# Altium project LimePSB-RPCM_1v4.PrjPcb (part 2 of 12)

## Sheet 06_Misc_1.SchDoc: Misc 1
size A3; Organization: Lime Microsystems; Address1: Surrey Tech Centre; Address2: Guildford GU2 7YG; Address3: Surrey; Address4: United Kingdom; Revision: 1.4; SheetNumber: 6; SheetTotal: 15
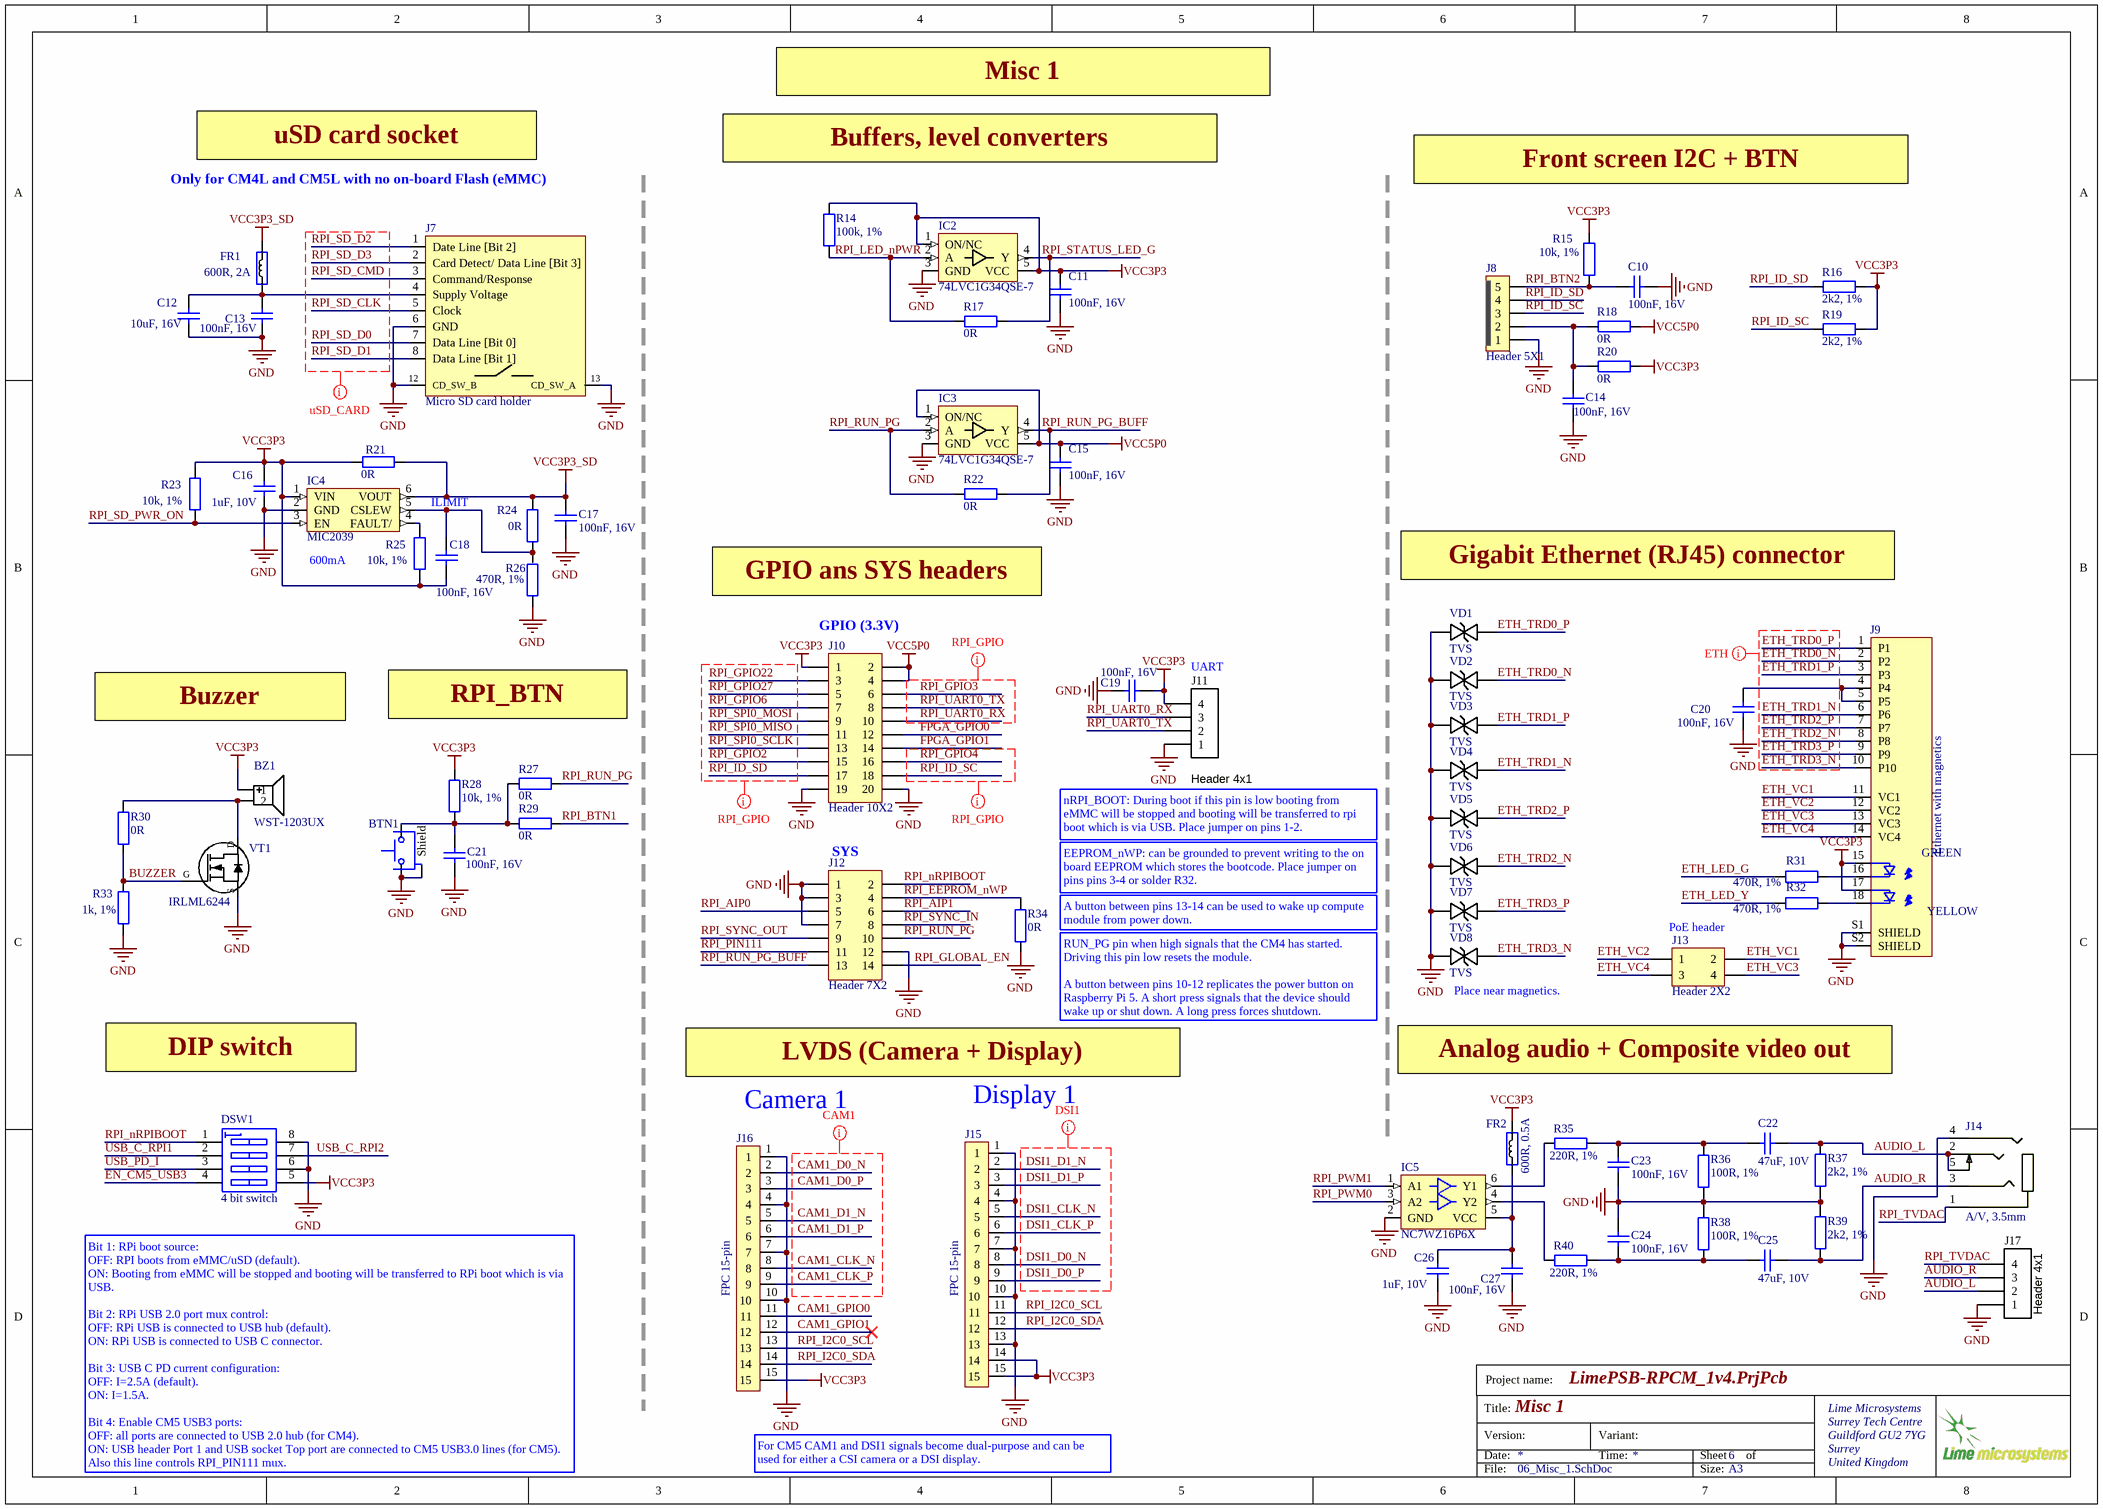
[diagram p5: 06_Misc_1.SchDoc]

### Parts
BTN1  Switch tactile right edge  [SW_TACTILE_RIGHT_EDGE]  (value not drawn)
BZ1  WST-1203UX  [BUZZER_WST-1203UX]
C10  100nF, 16V  [CAP0402]
C11  100nF, 16V  [CAP0402]
C12  10uF, 16V  [CAP0603]
C13  100nF, 16V  [CAP0402]
C14  100nF, 16V  [CAP0402]
C15  100nF, 16V  [CAP0402]
C16  1uF, 10V  [CAP0402]
C17  100nF, 16V  [CAP0402]
C18  100nF, 16V  [CAP0402]
C19  100nF, 16V  [CAP0402]
C20  100nF, 16V  [CAP0402]
C21  100nF, 16V  [CAP0402]
C22  47uF, 10V  [CAP1206]
C23  100nF, 16V  [CAP0402]
C24  100nF, 16V  [CAP0402]
C25  47uF, 10V  [CAP1206]
C26  1uF, 10V  [CAP0402]
C27  100nF, 16V  [CAP0402]
DSW1  4 bit switch  [SW_4WAY_SMD_1P27]
FR1  600R, 2A  [RES0805]
FR2  600R, 0.5A  [RES0402]
IC2  74LVC1G34QSE-7  [74AHCT1G126SE-7_BUFFER_SOT353]
IC3  74LVC1G34QSE-7  [74AHCT1G126SE-7_BUFFER_SOT353]
IC4  MIC2039  [SOT23-6]
IC5  NC7WZ16P6X  [SC-70_NC7WZ16P6X]
J7  Micro SD card holder  [MICRO_SD_CARD_114-00841-68_v2]
J8  Header 5X1  [Header1x5_TH_LOCKING]
J9  Ethernet with magnetics  [RJ45_ETHERNET_MAG_A70-112-331N126]
J10  Header 10X2  [HEADER10X2_TH_LOCK]
J11  Header 4x1  [HEADER4X1_TH]
J12  Header 7X2  [Header7x2_TH]
J13  Header 2X2  [Header2x2_TH]
J14  A/V, 3.5mm  [Audio_jack_3.5mm]
J15  FPC 15-pin  [FPC_CONNECTOR_15pin_1-1734248-5]
J16  FPC 15-pin  [FPC_CONNECTOR_15pin_1-1734248-5]
J17  Header 4x1  [HEADER4X1_TH]
R14  100k, 1%  [RES0402]
R15  10k, 1%  [RES0402]
R16  2k2, 1%  [RES0402]
R17  0R  [RES0402]
R18  0R  [RES0402]
R19  2k2, 1%  [RES0402]
R20  0R  [RES0402]
R21  0R  [RES0402]
R22  0R  [RES0402]
R23  10k, 1%  [RES0402]
R24  0R  [RES0402]
R25  10k, 1%  [RES0402]
R26  470R, 1%  [RES0402]
R27  0R  [RES0402_v2]
R28  10k, 1%  [RES0402]
R29  0R  [RES0402_v2]
R30  0R  [RES0402]
R31  470R, 1%  [RES0402]
R32  470R, 1%  [RES0402]
R33  1k, 1%  [RES0402]
R34  0R  [RES0402]
R35  220R, 1%  [RES0402]
R36  100R, 1%  [RES0402]
R37  2k2, 1%  [RES0402]
R38  100R, 1%  [RES0402]
R39  2k2, 1%  [RES0402]
R40  220R, 1%  [RES0402]
VD1  TVS  [SOD323]
VD2  TVS  [SOD323]
VD3  TVS  [SOD323]
VD4  TVS  [SOD323]
VD5  TVS  [SOD323]
VD6  TVS  [SOD323]
VD7  TVS  [SOD323]
VD8  TVS  [SOD323]
VT1  IRLML6244  [SOT23-3]

### Nets
GND: BTN1.2 BTN1.Shield C10.2 C11.2 C12.1 C13.2 C14.2 C15.2 C16.2 C17.2 C19.2 C20.2 C21.2 C23.2 C24.1 C26.1 C27.2 DSW1.6(B3) DSW1.8(B1) IC2.3(GND) IC3.3(GND) IC4.2(GND) IC5.2(GND) J7.6(GND) J7.12(CD_SW_B) J7.13(CD_SW_A) J8.1 J9.S1(SHIELD) J9.S2(SHIELD) J10.19 J10.20 J11.1 J12.1 J12.3 J12.7 J12.12 J14.4 J15.1 J15.4 J15.7 J15.10 J15.13 J16.1 J16.4 J16.7 J16.10 J17.1 R26.1 R33.2 R34.1 R36.1 R37.2 R38.2 R39.1 VD1.K VD2.K VD3.K VD4.K VD5.K VD6.K VD7.K VD8.K VT1.S
VCC3P3: BZ1.1 C11.1 C16.1 C18.2 C19.1 DSW1.5(B4) FR2.2 IC2.1(ON/NC) IC2.5(VCC) IC4.1(VIN) J9.15(G_A) J9.17(Y_A) J10.1 J11.4 J15.14 J15.15 J16.15 R14.1 R15.1 R16.2 R19.2 R20.1 R21.2 R23.2 R25.1 R28.1
VCC3P3_SD: C17.1 FR1.2 IC4.6(VOUT) R21.1 R24.2
VCC5P0: C15.1 IC3.1(ON/NC) IC3.5(VCC) J10.2 J10.4 R18.1
AUDIO_L: C22.1 J14.2 J14.5 J17.2 R37.1
AUDIO_R: C25.1 J14.3 J17.3 R39.2
BUZZER: R30.1 R33.1 VT1.G
CAM1_CLK_N: J16.8
CAM1_CLK_P: J16.9
CAM1_D0_N: J16.2
CAM1_D0_P: J16.3
CAM1_D1_N: J16.5
CAM1_D1_P: J16.6
CAM1_GPIO0: J16.11
CAM1_GPIO1: J16.12
DSI1_CLK_N: J15.5
DSI1_CLK_P: J15.6
DSI1_D0_N: J15.8
DSI1_D0_P: J15.9
DSI1_D1_N: J15.2
DSI1_D1_P: J15.3
EN_CM5_USB3: DSW1.4(A4)
ETH_LED_G: R31.2
ETH_LED_Y: R32.2
ETH_TRD0_N: J9.2(P2) VD2.A
ETH_TRD0_P: J9.1(P1) VD1.A
ETH_TRD1_N: J9.6(P6) VD4.A
ETH_TRD1_P: J9.3(P3) VD3.A
ETH_TRD2_N: J9.8(P8) VD6.A
ETH_TRD2_P: J9.7(P7) VD5.A
ETH_TRD3_N: J9.10(P10) VD8.A
ETH_TRD3_P: J9.9(P9) VD7.A
ETH_VC1: J9.11(VC1) J13.2
ETH_VC2: J9.12(VC2) J13.1
ETH_VC3: J9.13(VC3) J13.4
ETH_VC4: J9.14(VC4) J13.3
FPGA_GPIO0: J10.12
FPGA_GPIO1: J10.14
RPI_AIP0: J12.5
RPI_AIP1: J12.6
RPI_BTN1: R29.1
RPI_BTN2: C10.1 J8.5 R15.2
RPI_EEPROM_nWP: J12.4 R34.2
RPI_GLOBAL_EN: J12.14
RPI_GPIO2: J10.15
RPI_GPIO3: J10.6
RPI_GPIO4: J10.16
RPI_GPIO6: J10.7
RPI_GPIO22: J10.3
RPI_GPIO27: J10.5
RPI_I2C0_SCL: J15.11 J16.13
RPI_I2C0_SDA: J15.12 J16.14
RPI_ID_SC: J8.3 J10.18 R19.1
RPI_ID_SD: J8.4 J10.17 R16.1
RPI_LED_nPWR: IC2.2(A) R14.2 R17.2
RPI_nRPIBOOT: DSW1.1(A1) J12.2
RPI_PIN111: J12.11
RPI_PWM0: IC5.3(A2)
RPI_PWM1: IC5.1(A1)
RPI_RUN_PG: IC3.2(A) J12.10 R22.2 R27.1
RPI_RUN_PG_BUFF: IC3.4(Y) J12.13 R22.1
RPI_SD_CLK: J7.5(Clock)
RPI_SD_CMD: J7.3(Command/Response)
RPI_SD_D0: J7.7(Data_Line_[Bit_0])
RPI_SD_D1: J7.8(Data_Line_[Bit_1])
RPI_SD_D2: J7.1(Date_Line_[Bit_2])
RPI_SD_D3: J7.2(Card_Detect/_Data_Line_[Bit_3])
RPI_SD_PWR_ON: IC4.3(EN) R23.1
RPI_SPI0_MISO: J10.11
RPI_SPI0_MOSI: J10.9
RPI_SPI0_SCLK: J10.13
RPI_STATUS_LED_G: IC2.4(Y) R17.1
RPI_SYNC_IN: J12.8
RPI_SYNC_OUT: J12.9
RPI_TVDAC: J14.1 J17.4
RPI_UART0_RX: J10.10 J11.3
RPI_UART0_TX: J10.8 J11.2
USB_C_RPI1: DSW1.2(A2)
USB_C_RPI2: DSW1.7(B2)
USB_PD_I: DSW1.3(A3)
NetBTN1_1: BTN1.1 C21.1 R27.2 R28.2 R29.2
NetBZ1_2: BZ1.2 R30.2 VT1.D
NetC12_2: C12.2 C13.1 FR1.1 J7.4(Supply_Voltage)
NetC14_1: C14.1 J8.2 R18.2 R20.2
NetC18_1: C18.1 IC4.5(CSLEW) R24.1 R26.2
NetC20_1: C20.1 J9.4(P4) J9.5(P5)
NetC22_2: C22.2 C23.1 R35.2 R36.2
NetC24_2: C24.2 C25.2 R38.1 R40.2
NetC26_2: C26.2 C27.1 FR2.1 IC5.5(VCC)
NetIC4_4: IC4.4(FAULT/) R25.2
NetIC5_4: IC5.4(Y2) R40.1
NetIC5_6: IC5.6(Y1) R35.1
NetJ9_16: J9.16(G_K) R31.1
NetJ9_18: J9.18(Y_K) R32.1

### Layout directives
net class uSD_CARD: RPI_SD_CLK, RPI_SD_CMD, RPI_SD_D0, RPI_SD_D1, RPI_SD_D2, RPI_SD_D3
net class ETH: ETH_TRD0_N, ETH_TRD0_P, ETH_TRD1_N, ETH_TRD1_P, ETH_TRD2_N, ETH_TRD2_P, ETH_TRD3_N, ETH_TRD3_P
net class CAM1: CAM1_CLK_N, CAM1_CLK_P, CAM1_D0_N, CAM1_D0_P, CAM1_D1_N, CAM1_D1_P
net class DSI1: DSI1_CLK_N, DSI1_CLK_P, DSI1_D0_N, DSI1_D0_P, DSI1_D1_N, DSI1_D1_P
net class RPI_GPIO: RPI_GPIO2, RPI_GPIO3, RPI_GPIO4, RPI_GPIO6, RPI_GPIO22, RPI_GPIO27, RPI_ID_SC, RPI_ID_SD, RPI_SPI0_MISO, RPI_SPI0_MOSI, RPI_SPI0_SCLK, RPI_UART0_RX, RPI_UART0_TX

### Notes on the sheet
- Misc 1
- uSD card socket
- (near R14) Buffers, level converters
- Front screen I2C + BTN
- Only for CM4L and CM5L with no on-board Flash (eMMC)
- ILIMIT
- (near IC4) 600mA
- Gigabit Ethernet (RJ45) connector
- GPIO ans SYS headers
- (near J10) GPIO (3.3V)
- Buzzer
- RPI_BTN
- (near J11) UART
- (near J12) SYS
- (near J11) nRPI_BOOT: During boot if this pin is low booting from eMMC will be stopped and booting will be transferred to rpi boot which is via USB. Place jumper on pins 1-2.
- (near R34) EEPROM_nWP: can be grounded to prevent writing to the on board EEPROM which stores the bootcode. Place jumper on pins pins 3-4 or solder R32.
- (near R34) A button between pins 13-14 can be used to wake up compute module from power down.
- (near J13) PoE header
- (near R34) RUN_PG pin when high signals that the CM4 has started. Driving this pin low resets the module.
  A button between pins 10-12 replicates the power button on Raspberry Pi 5. A short press signals that the device should wake up or shut down. A long press forces shutdown.
- (near VD8) Place near magnetics.
- DIP switch
- LVDS (Camera + Display)
- (near J16) Camera 1
- (near J15) Display 1
- Analog audio + Composite video out
- (near DSW1) Bit 1: RPi boot source:
  OFF: RPI boots from eMMC/uSD (default).
  ON: Booting from eMMC will be stopped and booting will be transferred to RPi boot which is via USB.
  Bit 2: RPi USB 2.0 port mux control:
  OFF: RPi USB is connected to USB hub (default).
  ON: RPi USB is connected to USB C connector.
  Bit 3: USB C PD current configuration:
  OFF: I=2.5A (default).
  ON: I=1.5A.
  Bit 4: Enable CM5 USB3 ports:
  OFF: all ports are connected to USB 2.0 hub (for CM4).
  ON: USB header Port 1 and USB socket Top port are connected to CM5 USB3.0 lines (for CM5).
  Also this line controls RPI_PIN111 mux.
- For CM5 CAM1 and DSI1 signals become dual-purpose and can be used for either a CSI camera or a DSI display.
- Project name:
- Title:
- Version:
- Date:
- Variant:
- Time:
- Sheet
- of
- File:
- Size:
- A3
- (in symbol RJ45_ETHERNET_MAG_A70-112-331N126) GREEN; YELLOW

### Library data of the parts
BTN1 = Button_right_edge: Part Description: Tactile Switch SPST-NO Side Actuated Through Hole, Right Angle; Manufacturer: CIT Relay & Switch; Manufacturer Part Number 1: CT1102V6.85F160; ComponentLink1URL: http://www.te.com/commerce/DocumentDelivery/DDEController?Action=srchrtrv&DocNm=1825027&DocType=Customer+Drawing&DocLang=English; ComponentLink1Description: http://www.te.com/commerce/DocumentDelivery/DDEController?Action=srchrtrv&DocNm=1825027&DocType=Customer+Drawing&DocLang=English; Supplier 1: Digikey; Supplier Part Number 1: 2449-CT1102V6.85F160-ND; Stock 1: 870; Pricing 1: 1=0,17, 10=0,167, 25=0,1584, 100=0,1436, 250=0,13088, 500=0,12164, 1000=0,10377, 3000=0,1015 (USD); RoHS: No
BZ1 = BUZZER_WST-1203UX: Manufacturer: Soberton Inc.; Part Description: Buzzers Indicator, Internally Driven Magnetic 3V 30mA 2.3kHz 82dB @ 3V, 10cm Through Hole PC Pins; Driver Circuitry: Indicator, Internally Driven; Input Type: Zero-Peak Signal; Voltage Range: 2 ~ 4V; Frequency: 2.3kHz; Operating Mode: Single Tone; Sound Pressure Level (SPL): 82dB @ 3V, 10cm; Current - Supply: 30mA; Port Location: Top; Ratings: Washable; Supplier 1: Digi-Key; Manufacturer Part Number 1: WST-1203UX; RoHS: RoHS Compliant; Category: Audio Products; Stock 1: 22696; Pricing 1: 1=1.41, 10=1.117, 25=1.0176, 50=0.9516, 100=0.8855, 250=0.80852, 500=0.7535, 1000=0.704, 5000=0.6875 (USD); Packaging: Tray; Part Status: Active; Technology: Magnetic; Duration: -; Operating Temperature: -20°C ~ 60°C; Approvals: -; Mounting Type: Through Hole; Termination: PC Pins; Size / Dimension: 0.472" Dia (12.00mm); Height - Seated (Max): 0.303" (7.70mm); ComponentLink1URL: http://cirlw3yrzg4afc1x47lv2k18.wpengine.netdna-cdn.com/wp-content/uploads/2016/12/WST-1203UX-new.pdf; ComponentLink1Description: http://cirlw3yrzg4afc1x47lv2k18.wpengine.netdna-cdn.com/wp-content/uploads/2016/12/WST-1203UX-new.pdf; Supplier Part Number 1: 433-1047-ND
C10 C13 C14 C19 C21 = Cap_0603: Manufacturer Part Number 1: GRM155R71C104KA88D; Part Description: 0.10µF ±10% 16V Ceramic Capacitor X7R 0402 (1005 Metric); Brand: Murata Electronics; Tolerance: 10 %; Type: General Purpose MLCC; Capacitance: 0.1 uF; Temperature Coefficient / Code: +/- 15 %; Supplier 1: Mouser; Supplier Part Number 1: 81-GRM155R71C104KA88; Case Code - in: 0402; Manufacturer: Murata Electronics; Category: Multilayer Ceramic Capacitors MLCC - SMD/SMT; Voltage Rating DC: 16 V; Value: 100nF, 16V; Manufacturer Part Number: GRM155R71C104KA88D
  C13 C19: Maximum Operating Temperature: + 125 C; Minimum Operating Temperature: - 55 C; Minimum Order Quantity: 1; Operating Temperature Range: - 55 C to + 125 C; Package / Case: 0402 (1005 metric); Packaging: Reel; Product: General Type MLCCs; Product Category: Low & Medium Capacitance SMD Ceramic Chip Capacitors; Reeling: True; RoHS - Mouser: Y; RoHS: RoHS Compliant; Series: GRM; Standard Pack Qty: 10000; Termination Style: SMD/SMT
C11 C15 C20 C23 C24 C27 = Cap_0402: Manufacturer: Murata Electronics; Manufacturer Part Number: GRM155R71C104KA88D; Part Description: 0.10µF ±10% 16V Ceramic Capacitor X7R 0402 (1005 Metric); Tolerance: 10 %; Type: General Purpose MLCC; Capacitance: 0.1 uF; Case Length: 1 mm; Dielectric: X7R; Case Height: 0.5 mm; Temperature Coefficient / Code: +/- 15 %; Value: 100nF, 16V; Supplier 1: Mouser; Supplier Part Number 1: 81-GRM155R71C104KA88; Case Code - in: 0402; RoHS: RoHS Compliant; Operating Temperature Range: - 55 C to + 125 C; Series: GRM; Termination Style: SMD/SMT; Package / Case: 0402 (1005 metric); Voltage Rating DC: 16 V; Maximum Operating Temperature: + 125 C; Case Code - mm: 1005; Minimum Operating Temperature: - 55 C; Product Category: Low & Medium Capacitance SMD Ceramic Chip Capacitors; Packaging: Reel; Product: General Type MLCCs; Category: Multilayer Ceramic Capacitors MLCC - SMD/SMT; Brand: Murata Electronics; Case Width: 0.5 mm; RoHS - Mouser: Y; Standard Pack Qty: 10000; Minimum Order Quantity: 1; Reeling: True; Manufacturer Part Number 1: GRM155R71C104KA88D
C12 = Cap_0603: Manufacturer: Yageo; Manufacturer Part Number 1: GRM188R61C106MA73D; Part Description: 10µF ±20% 16V Ceramic Capacitor X5R 0603 (1608 Metric); Temperature Coefficient: X5R; Capacitance: 10µF; Tolerance: ±20%; Value: 10uF, 16V; Supplier 1: Digi-Key; Supplier Part Number 1: 490-7201-2-ND; Category: Capacitors; Ratings: -; Features: -; Lead Style: -; Package / Case: 0603 (1608 Metric); Lead Spacing: -; Applications: General Purpose; Voltage - Rated: 16V; Operating Temperature: -55°C ~ 85°C; Thickness (Max): 0.039" (1.00mm); Mounting Type: Surface Mount, MLCC; RoHS: RoHS Compliant; Size / Dimension: 0.063" L x 0.031" W (1.60mm x 0.80mm); Packaging: Tape & Reel (TR); Height - Seated (Max): -
C16 = Cap_0402: Manufacturer Part Number 1: CC0402MRX5R6BB105; Manufacturer: Yageo; Part Description: 1µF 10V Ceramic Capacitor X5R 0402 (1005 Metric) 0.039" L x 0.020" W (1.00mm x 0.50mm); Voltage Rating: 10; Capacitance Tolerance: ± 10%; Product Range: TDK - C Series; Ceramic Capacitor Case: 0402 [1005 Metric]; Capacitance: 1; Dielectric Characteristic: X6; Value: 1uF, 10V; Supplier 1: Digi-Key; Supplier Part Number 1: 311-1732-1-ND; MSL: -; RoHS: YES
C17 C18 = Cap_0402: Manufacturer: Murata Electronics; Manufacturer Part Number 1: GRM155R71C104KA88D; Part Description: 0.10µF ±10% 16V Ceramic Capacitor X7R 0402 (1005 Metric); Tolerance: 10 %; Type: General Purpose MLCC; Capacitance: 0.1 uF; Case Length: 1 mm; Dielectric: X7R; Case Height: 0.5 mm; Temperature Coefficient / Code: +/- 15 %; Value: 100nF, 16V; Supplier 1: Mouser; Supplier Part Number 1: 81-GRM155R71C104KA88; Case Code - in: 0402; RoHS: RoHS Compliant; Operating Temperature Range: - 55 C to + 125 C; Series: GRM; Termination Style: SMD/SMT; Package / Case: 0402 (1005 metric); Voltage Rating DC: 16 V; Maximum Operating Temperature: + 125 C; Case Code - mm: 1005; Minimum Operating Temperature: - 55 C; Product Category: Low & Medium Capacitance SMD Ceramic Chip Capacitors; Packaging: Reel; Product: General Type MLCCs; Category: Multilayer Ceramic Capacitors MLCC - SMD/SMT; Brand: Murata Electronics; Case Width: 0.5 mm; RoHS - Mouser: Y; Standard Pack Qty: 10000; Minimum Order Quantity: 1; Reeling: True; Manufacturer Part Number: GRM155R71C104KA88D
C22 C25 = Cap_1206: Manufacturer: TDK Corporation; Manufacturer Part Number 1: C3216X6S1A476M160AC; Part Description: 47µF ±20% 10V Ceramic Capacitor X6S 1206 (3216 Metric); Notification: Current market demand for these product types have resulted in fluctuating and extending lead times. Lead times may differ.; Tolerance: ±20%; Temperature Coefficient: X6S; Value: 47uF, 10V; RoHS: RoHS Compliant; Packaging: Cut Tape (CT); Operating Temperature: -55°C ~ 105°C; Voltage - Rated: 10V; Height - Seated (Max): -; Ratings: -; Applications: General Purpose; Features: Low ESL; Size / Dimension: 0.126" L x 0.063" W (3.20mm x 1.60mm); Supplier 1: Digi-Key; Lead Spacing: -; Supplier Part Number 1: 445-6010-1-ND; Thickness (Max): 0.071" (1.80mm); Failure Rate: -; Category: Capacitors; Lead Style: -; Part Status: Active; Mounting Type: Surface Mount, MLCC; Package / Case: 1206 (3216 Metric)
C26 = Cap_0402: CAP CER 1UF 10V X5R 0402; Manufacturer: Yageo; Part Description: 1µF 10V Ceramic Capacitor X5R 0402 (1005 Metric) 0.039" L x 0.020" W (1.00mm x 0.50mm); Manufacturer Part Number 1: CC0402MRX5R6BB105; Notification: Current market demand for these product types have resulted in fluctuating and extending lead times. Lead times may differ.; Tolerance: ±20%; Value: 1uF, 10V; Supplier 1: Digi-Key; Supplier Part Number 1: 311-1732-1-ND; RoHS: RoHS Compliant; Applications: General Purpose; Category: Capacitors; ComponentLink1Description: http://www.yageo.com/documents/recent/UPY-GPHC_X5R_4V-to-50V_25.pdf; ComponentLink1URL: http://www.yageo.com/documents/recent/UPY-GPHC_X5R_4V-to-50V_25.pdf; Failure Rate: -; Features: -; Height - Seated (Max): -; Lead Spacing: -; Lead Style: -; Mounting Type: Surface Mount, MLCC; Operating Temperature: -55°C ~ 85°C; Package / Case: 0402 (1005 Metric); Packaging: Cut Tape (CT); Part Status: Active; Pricing 1: 1=0.22, 10=0.156, 100=0.0732, 500=0.0513, 1000=0.04248, 2500=0.03953, 5000=0.03617 (USD); Ratings: -; Size / Dimension: 0.039" L x 0.020" W (1.00mm x 0.50mm); Stock 1: 69600; Temperature Coefficient: X5R; Thickness (Max): 0.022" (0.55mm); Voltage - Rated: 10V
DSW1 = SW_SM_4bit: Manufacturer Part Number 1: A6H-4101; Manufacturer: Omron Electronics Inc-EMC Div; Part Description: Dip Switch SPST 4 Position Surface Mount Slide (Standard) Actuator 25mA 24VDC; Pitch: 0.050" (1.27mm), Half; Mechanical Life: 1,000 Cycles; Washable: No; Current Rating: 25mA; Number of Positions: 4; Voltage Rating: 24VDC; Actuator Level: Flush, Recessed; Circuit: SPST; Actuator Type: Slide (Standard); Supplier 1: Digi-Key; Height Above Board: 0.061" (1.55mm); RoHS: RoHS Compliant; Termination Style: Gull Wing; Electrical Life: 1,000 Cycles; Length: 0.248" (6.31mm); Category: Switches; Operating Temperature: -20°C ~ 70°C; Body Material: -; Contact Material: -; Features: -; Mounting Type: Surface Mount; Contact Finish: -; Packaging: Tube; Supplier Part Number 1: SW1080-ND
FR1 = Ferrite: Manufacturer Part Number 1: MPZ2012S601AT000; Manufacturer: TDK Corporation; Part Description: FERRITE BEAD 600 OHM 0805 1LN; Filter Type: Differential Mode - Single; Impedance @ Frequency: 600 Ohm @ 100MHz; DC Resistance (DCR): 100 mOhm Max; Supplier 1: Digi-Key; Supplier Part Number 1: 445-2206-2-ND; Mounting Type: Surface Mount; RoHS: RoHS Compliant; Height (Max): 0.041" (1.05mm); Packaging: Tape & Reel (TR); Category: Filters; Current Rating: 2A; Package / Case: 0805 (2012 Metric); Size / Dimension: 0.079" L x 0.049" W (2.00mm x 1.25mm)
FR2 = Ferrite: Manufacturer: Murata; Manufacturer Part Number 1: BLM15AX601SN1D; Part Description: - Ferrite Bead 0402 (1005 Metric) 500mA 340mOhm; Tolerance: 25%; Current Rating: 500mA; Number of Lines: 1; DC Resistance (DCR): 340mR; Test Frequency: 100MHz; Value: 600R, 0.5A; Supplier 1: Digi-Key; Supplier Part Number 1: 490-5441-1-ND; Stock 1: 416370; Pricing 1: 1=0.1, 10=0.06, 25=0.0552, 50=0.0496, 100=0.0363, 250=0.0264, 500=0.0242, 1000=0.0209, 5000=0.0165 (USD); Case/Package: 0402; Number of Pins: 2; Case Code (Metric): 1005; Case Code (Imperial): 0402; Core Material: Ferrite; Material: Steel,Ferrite; Min Operating Temperature: -55°C; Max Operating Temperature: 125°C; Package Quantity: 1; Packaging: Tape and Reel; Series: BLM15AX_SN; Impedance: 600R; Max Current Rating: 500mA; Termination: SMD/SMT; Max DC Current: 500mA; Number of Circuits: 1; DC Resistance-Max: 340mR; Length: 1mm; Width: 0.5mm; Height: 0.5mm; Depth: 0.5mm; REACH SVHC: No SVHC; Lead Free: Lead Free; RoHS Compliant: Yes; ComponentLink1URL: https://www.murata.com/en-us/products/productdata/8796740059166/ENFA0018.pdf?src-supplier=Digi-Key; ComponentLink1Description: https://www.murata.com/en-us/products/productdata/8796740059166/ENFA0018.pdf?src-supplier=Digi-Key; ComponentLink2URL: http://search.murata.co.jp/Ceramy/image/img/PDF/ENG/L0110S0100BLM15AX_SN.pdf?src-supplier=Future+Electronics; ComponentLink2Description: http://search.murata.co.jp/Ceramy/image/img/PDF/ENG/L0110S0100BLM15AX_SN.pdf?src-supplier=Future+Electronics; ComponentLink3URL: http://www.produktinfo.conrad.com/datenblaetter/1100000-1199999/001171675-da-01-en-CHIP_DROSSEL0402_600R_420MA_1_0X0_5MM.pdf?src-supplier=Conrad; ComponentLink3Description: http://www.produktinfo.conrad.com/datenblaetter/1100000-1199999/001171675-da-01-en-CHIP_DROSSEL0402_600R_420MA_1_0X0_5MM.pdf?src-supplier=Conrad; ComponentLink4URL: http://www.produktinfo.conrad.com/datenblaetter/1100000-1199999/001172169-da-01-en-DROSSEL_0402_600R_1_0X0_5MM_10000ST.pdf?src-supplier=Conrad; ComponentLink4Description: http://www.produktinfo.conrad.com/datenblaetter/1100000-1199999/001172169-da-01-en-DROSSEL_0402_600R_1_0X0_5MM_10000ST.pdf?src-supplier=Conrad
IC2 IC3 = 74AHCT1G126SE-7_BUFFER_NON_INV: Part Description: Buffers & Line Drivers Logic LVC 1 Gate SOT353 T&R 3K; Manufacturer: Diodes; ComponentLink1URL: https://datasheet.ciiva.com/12256/74ahct1g126-80154-12256741.pdf?src-supplier=Mouser; ComponentLink1Description: https://datasheet.ciiva.com/12256/74ahct1g126-80154-12256741.pdf?src-supplier=Mouser; ComponentLink2URL: https://datasheet.ciiva.com/26949/getdatasheetpartid-792439-26949318.pdf?src-supplier=Verical; ComponentLink2Description: https://datasheet.ciiva.com/26949/getdatasheetpartid-792439-26949318.pdf?src-supplier=Verical; ComponentLink3URL: https://datasheet.ciiva.com/1832/74ahct1g126-1832523.pdf?src-supplier=Digi-Key; ComponentLink3Description: https://datasheet.ciiva.com/1832/74ahct1g126-1832523.pdf?src-supplier=Digi-Key; ComponentLink4URL: https://datasheet.ciiva.com/1832/74ahct1g126-1832524.pdf?src-supplier=Digi-Key; ComponentLink4Description: https://datasheet.ciiva.com/1832/74ahct1g126-1832524.pdf?src-supplier=Digi-Key; ComponentLink5URL: https://datasheet.ciiva.com/1154/74ahct1g126-1154309.pdf?src-supplier=Element14; ComponentLink5Description: https://datasheet.ciiva.com/1154/74ahct1g126-1154309.pdf?src-supplier=Element14; ComponentLink6URL: https://datasheet.ciiva.com/26939/getdatasheetpartid-779272-26939183.pdf?src-supplier=Verical; ComponentLink6Description: https://datasheet.ciiva.com/26939/getdatasheetpartid-779272-26939183.pdf?src-supplier=Verical; Supplier 1: Mouser; Supplier Part Number 1: 621-74LVC1G34QSE-7; Manufacturer Part Number 1: 74LVC1G34QSE-7; Stock 1: 1171; Pricing 1: 1=0,45000, 10=0,33900, 50=0,33900, 100=0,17800, 1000=0,11200, 10000=0,09400 (USD); RoHS: Yes
IC4 = MIC2033_power_switch: Part Description: Power Switch/Driver 1:1 P-Channel 2.5A SOT-23-6; Manufacturer: Microchip; Manufacturer Part Number 1: MIC2039EYM6-TR; Number of Outputs: 1; Interface: On/Off; Max Output Current: 2.5A; Fault Protection: Over Temperature; Output Configuration: High Side; ComponentLink1URL: http://www.mouser.com/ds/2/268/mic2033-b-1076865.pdf?src-supplier=Mouser; ComponentLink1Description: http://www.mouser.com/ds/2/268/mic2033-b-1076865.pdf?src-supplier=Mouser; ComponentLink2URL: http://components.arrow.com/part/dataview/56727820S413982N1374?src-supplier=Arrow+Electronics; ComponentLink2Description: http://components.arrow.com/part/dataview/56727820S413982N1374?src-supplier=Arrow+Electronics; ComponentLink3URL: http://www.microchip.com/mymicrochip/filehandler.aspx?ddocname=en579457&src-supplier=Digi-Key; ComponentLink3Description: http://www.microchip.com/mymicrochip/filehandler.aspx?ddocname=en579457&src-supplier=Digi-Key; Supplier 1: Digi-Key; Supplier Part Number 1: 576-4193-1-ND; Stock 1: 37195; Pricing 1: 1=0,98000, 25=0,80560, 100=0,75000 (USD); RoHS: No; Case/Package: SOT-23-6; Min Operating Temperature: -40°C; Max Operating Temperature: 125°C; Package Quantity: 3000; Packaging: Tape and Reel; Series: -; ComponentLink4URL: https://datasheet.ciiva.com/6607/mic2039-6607725.pdf?src-supplier=Digi-Key; ComponentLink4Description: https://datasheet.ciiva.com/6607/mic2039-6607725.pdf?src-supplier=Digi-Key
IC5 = NC7WZ16P6X_DUAL_BUFFER: Manufacturer: Nexperia; Manufacturer Part Number 1: 74LVC2G34GW,125; Part Description: Buffer, Non-Inverting 2 Element 1 Bit per Element Push-Pull Output 6-TSSOP; Supplier 1: Digi-Key; Supplier Part Number 1: 1727-4219-1-ND; Stock 1: 2900; Pricing 1: 1=0,430000, 10=0,321000, 25=0,281200, 100=0,182000, 250=0,150640, 500=0,120520, 1000=0,092400 (USD); RoHS: Yes; RoHS Compliant: Yes; ComponentLink1URL: https://assets.nexperia.com/documents/data-sheet/74LVC2G34.pdf?src-supplier=Digi-Key; ComponentLink1Description: https://assets.nexperia.com/documents/data-sheet/74LVC2G34.pdf?src-supplier=Digi-Key
J7 = MICRO_SD_114-00841-68: Manufacturer: Amphenol Commercial Products; Part Description: 10 (8 + 2) Position Card Connector Secure Digital - microSD™ Surface Mount, Right Angle Gold; Card Type: Secure Digital - microSD™; Number of Positions: 10 (8 + 2); Connector Type: Connector; Insertion, Removal Method: Push In, Pull Out; Supplier 1: Digi-Key; Manufacturer Part Number 1: 114-00841-68; RoHS: RoHS Compliant; Category: Connectors, Interconnects; Stock 1: 5866; Pricing 1: 1=1.5, 10=1.358, 25=1.2752, 50=1.2196, 100=1.1642, 250=1.05336, 500=0.9702 (USD); Packaging: Cut Tape (CT); Part Status: Active; Ejector Side: -; Mounting Type: Surface Mount, Right Angle; Features: Switch; Height Above Board: 0.061" (1.55mm); Mounting Feature: Normal, Standard - Top; Contact Finish: Gold; Contact Finish Thickness: 15.0µin (0.38µm); ComponentLink1URL: https://www.amphenolcanada.com/ProductSearch/drawings/AC/1140084168.pdf; ComponentLink1Description: https://www.amphenolcanada.com/ProductSearch/drawings/AC/1140084168.pdf; Supplier Part Number 1: 114-00841-68-1-ND
J8 = Header 5X1 LOCK: Manufacturer 1: Molex; Manufacturer Part Number: 0022112052; Part Description: Connector Header Through Hole 5 position 0.100" (2.54mm); Supplier 1: Digi-Key; Supplier Part Number 1: WM2703-ND; Stock 1: 17764; Pricing 1: 1=1,01000, 10=0,83600, 100=0,69690, 1000=0,55752, 5000=0,48783, 10000=0,46344 (USD); RoHS: Yes; ComponentLink1URL: https://www.molex.com/pdm_docs/sd/022112052_sd.pdf?src-supplier=Digi-Key; ComponentLink1Description: https://www.molex.com/pdm_docs/sd/022112052_sd.pdf?src-supplier=Digi-Key; Manufacturer: Molex; Manufacturer Part Number 1: 0022112052
J9 = RJ45_ETHERNET_MAG_A70-112-331N126: MagJack A70-112-331N126 or LINK-PP LPJG0926HENL; Part Description: A70-112-331N126 Tab Down Ethernet Magnetic RJ45 Connector LPJG0926HENL With POE +; Manufacturer Part Number 1: LPJG0926HENL; Supplier Part Number 1: LPJG0926HENL; Supplier 1: Link-PP; Manufacturer: Link-PP
J10 = Header 10X2: Header, 10-Pin, Dual row; Manufacturer: On-Shore Technology; Manufacturer Part Number 1: 302-S201; Part Description: Connector Header Through Hole 20 position 0.100" (2.54mm); Number of Positions: 20; Connector Type: Male Pin; Pitch: 0.1inch; ComponentLink1URL: https://datasheet.ciiva.com/712/901301108-sd-712105.pdf?src-supplier=Digi-Key; ComponentLink1Description: https://datasheet.ciiva.com/712/901301108-sd-712105.pdf?src-supplier=Digi-Key; ComponentLink2URL: https://datasheet.ciiva.com/5153/0901301220-pcb-headers-151695-5153154.pdf?src-supplier=Mouser; ComponentLink2Description: https://datasheet.ciiva.com/5153/0901301220-pcb-headers-151695-5153154.pdf?src-supplier=Mouser; ComponentLink3URL: https://datasheet.ciiva.com/11747/0900766b8002f27a-11747298.pdf?src-supplier=RSComponents; ComponentLink3Description: https://datasheet.ciiva.com/11747/0900766b8002f27a-11747298.pdf?src-supplier=RSComponents; ComponentLink4URL: https://datasheet.ciiva.com/30106/205030901301220-pcb-headers-30106975.pdf?src-supplier=Onlinecomponents.com; ComponentLink4Description: https://datasheet.ciiva.com/30106/205030901301220-pcb-headers-30106975.pdf?src-supplier=Onlinecomponents.com; ComponentLink5URL: https://datasheet.ciiva.com/10076/0901301220-pcb-headers-10076926.pdf?src-supplier=Avnet; ComponentLink5Description: https://datasheet.ciiva.com/10076/0901301220-pcb-headers-10076926.pdf?src-supplier=Avnet; Supplier 1: Digi-Key; Supplier Part Number 1: ED10524-ND; Stock 1: 302635; Pricing 1: 1=0,48000, 10=0,40700, 160=0,31675, 480=0,27148, 960=0,22624, 4960=0,19392, 10080=0,18099 (USD); RoHS: Yes; Mount: Through Hole; Color: Black; Contact Plating: Gold; Number of Rows: 2; Packaging: Tray; Series: 302; Contact Type: Male Pin; Termination: Solder; Row Spacing: 0.1inch; RoHS Compliant: Yes; ComponentLink6URL: https://datasheet.ciiva.com/742/302-sxxx-742190.pdf?src-supplier=Digi-Key; ComponentLink6Description: https://datasheet.ciiva.com/742/302-sxxx-742190.pdf?src-supplier=Digi-Key
J11 J17 = Header4P: Header, 4-pin; Part Description: 4 Positions Header Connector 0.100" (2.54mm) Through Hole Gold; Manufacturer: Wurth Electronics Inc.; Manufacturer Part Number 1: 61300411121; Pitch - Mating: 0.100" (2.54mm); Number of Positions: 4; Number of Positions Loaded: All; Style: Board to Board or Cable; Shrouding: Unshrouded; Contact Length - Mating: 0.236" (6.00mm); Contact Length - Post: 0.118" (3.00mm); Overall Contact Length: 0.454" (11.54mm); Material Flammability Rating: UL94 V-0; Current Rating: 3A; Voltage Rating: 250V; Supplier 1: Digi-Key; Supplier Part Number 1: 732-5317-ND; RoHS: RoHS Compliant; Category: Connectors, Interconnects; Stock 1: 25204; Pricing 1: 1=0.18, 10=0.153, 25=0.1272, 50=0.106, 100=0.096, 1000=0.088 (USD); Packaging: Bulk; Part Status: Active; Connector Type: Header; Contact Type: Male Pin; Number of Rows: 1; Row Spacing - Mating: -; Mounting Type: Through Hole; Termination: Solder; Fastening Type: Push-Pull; Insulation Height: 0.100" (2.54mm); Contact Shape: Square; Contact Finish - Mating: Gold; Contact Finish Thickness - Mating: -; Contact Finish - Post: -; Contact Material: Copper Alloy; Insulation Material: Polybutylene Terephthalate (PBT); Features: -; Operating Temperature: -40°C ~ 125°C; Ingress Protection: -; Insulation Color: Black; Mated Stacking Heights: -; Contact Finish Thickness - Post: -; Applications: -; ComponentLink1URL: http://katalog.we-online.de/em/datasheet/6130xx11121.pdf; ComponentLink1Description: http://katalog.we-online.de/em/datasheet/6130xx11121.pdf
J12 = Header 7X2: Header, 7-Pin, Dual row; Manufacturer 1: Adam Equipment; Manufacturer Part Number: PH2-14-UA; Part Description: Connector Header Through Hole 14 position 0.100" (2.54mm); Number of Positions: 14; Pitch: 2.54mm; Supplier 1: Digi-Key; Supplier Part Number 1: 2057-PH2-14-UA-ND; Stock 1: 11861; Pricing 1: 1=0,24000, 10=0,19900, 100=0,15340, 500=0,12976, 1000=0,10617, 5000=0,09437, 10000=0,08553 (USD); RoHS: Yes; Termination: Solder; Lead Free: Lead Free; ComponentLink1URL: https://datasheet.ciiva.com/16397/ph2-14-ua-16397187.pdf?src-supplier=Future+Electronics; ComponentLink1Description: https://datasheet.ciiva.com/16397/ph2-14-ua-16397187.pdf?src-supplier=Future+Electronics; Manufacturer: Adam Equipment; Manufacturer Part Number 1: PH2-14-UA
J13 = Header 2X2: Header, 2-Pin, Dual row; Manufacturer 1: Adam Equipment; Manufacturer Part Number: PH2-04-UA; Part Description: Connector Header Through Hole 4 position 0.100" (2.54mm); Number of Positions: 4; Pitch: 2.54mm; Supplier 1: Digi-Key; Supplier Part Number 1: 2057-PH2-04-UA-ND; Stock 1: 10153; Pricing 1: 1=0,10000, 10=0,06900, 100=0,05120, 500=0,04234, 1000=0,03704, 5000=0,03175, 10000=0,03087 (USD); RoHS: Yes; Termination: Solder; Packaging: Box; Lead Free: Lead Free; ComponentLink1URL: https://datasheet.ciiva.com/16476/catpg250-254-16476106.pdf?src-supplier=Future+Electronics; ComponentLink1Description: https://datasheet.ciiva.com/16476/catpg250-254-16476106.pdf?src-supplier=Future+Electronics; Manufacturer: Adam Equipment; Manufacturer Part Number 1: PH2-04-UA
J14 = AUDIO_JACK_3mm5_SJ-4351X: Manufacturer: CUI Inc.; Manufacturer Part Number 1: SJ-43515TS; Part Description: CONN JACK 4COND 3.5MM R/A; Connector Type: Phone Jack; Gender: Female; Signal Lines: Multiple; Industry Recognized Mating Diameter: 3.50mm (0.141", 1/8", Mini Plug) - Headphone; Actual Diameter: 0.142" (3.60mm); Number of Positions/Contacts: 4 Conductors, 5 Contacts; Internal Switch(s): Single Switch; Shielding: Unshielded; Voltage - Rated: 12VDC; Current Rating: 1A; Mating Length/Depth: 0.551" (14.00mm); Body Color: Black; Supplier 1: Digi-Key; RoHS: RoHS Compliant; Category: Connectors, Interconnects; Stock 1: 62424; Pricing 1: 1=1.04, 10=0.91, 25=0.8568, 50=0.8212, 100=0.7854, 250=0.714, 500=0.6426, 1000=0.5712, 2500=0.51765 (USD); Packaging: Bulk; Part Status: Active; Mounting Type: Through Hole, Right Angle; Termination: Solder; Features: -; Insulation Color: -; Contact Material - Plating: Gold; Body Material: -; Includes: -; Housing Material: Polyamide (PA66), Nylon 6/6; Contact Material: Brass, Copper Alloy, Phosphor Bronze; Cable Opening: -; Panel Hole Size: -; Thread Size: -; Operating Temperature: -20°C ~ 85°C; ComponentLink1URL: http://www.cui.com/product/resource/digikeypdf/sj-4351x.pdf; ComponentLink1Description: http://www.cui.com/product/resource/digikeypdf/sj-4351x.pdf; Supplier Part Number 1: CP-43515TS-ND
J15 J16 = FPC_CONNECTOR_15pin_1-1734248-5: Manufacturer: TE Connectivity; Part Description: 15 Position FPC Connector Contacts, Vertical, 1 Sided 0.039" (1.00mm) Surface Mount; Current Rating: 1A; Voltage Rating: 125V; Gender: Receptacle; Number of Positions: 15; Shielding: Unshielded; Connector Type: Connector,Receptacle,Socket; Wire/Cable Type: Flat Flex; Connector System: Flex-to-Board; Mating Alignment: Yes (With); PCB Mount Alignment: No (Without); PCB Mount Retention: With; Circuit Application: Signal; Pitch: 1mm; Supplier 1: Digi-Key; Manufacturer Part Number 1: 1-1734248-5; Stock 1: 11808; Pricing 1: 1=1.03, 10=0.909, 25=0.8556, 50=0.82, 100=0.7843, 250=0.713, 500=0.6417 (USD); Mount: Surface Mount; Contact Plating: Gold; Contact Material: Bronze; Housing Colour: Black; Housing Material: Thermoplastic; Min Operating Temperature: -4°C; Max Operating Temperature: 185°C; Package Quantity: 1000; Packaging: Tape and Reel; Number of Rows: 1; Termination: SMD/SMT; Number of Contacts: 15; Orientation: Straight; Sealable: No (Without); Shrouded: Yes (With); Contact Current Rating: 1A; Length: 22.4mm; Height: 7.7mm; Width: 4.6mm; Depth: 4.6mm; REACH SVHC: Unknown; ELV: Compliant; Flammability Rating: UL94 V-0; Supplier Part Number 1: A101418DKR-ND
R14 = Res_0402: Part Description: 100 kOhms ±1% 0.063W, 1/16W Chip Resistor 0402 (1005 Metric) Thick Film; Manufacturer: Vishay; Manufacturer Part Number 1: CRCW0402100KFKEDC; Power Rating: 62.5mW; Resistance: 100kR; Temperature Coefficient: 100ppm/°C; Value: 100k, 1%; Supplier 1: Digi-Key; Supplier Part Number 1: 541-3960-6-ND; Stock 1: 702107; Pricing 1: 1=0,10000, 10=0,03300, 100=0,01360, 1000=0,00610, 2500=0,00529, 5000=0,00437 (USD); RoHS: Yes; Mount: Surface Mount; Case/Package: SMD/SMT; Contact Plating: Tin; Min Operating Temperature: -55°C; Max Operating Temperature: 155°C; Tolerance: 1%; Resistor Type: Thick Film; Termination: Wraparound; Length: 1mm; Lead Free: Lead Free; RoHS Compliant: Yes; ComponentLink1URL: http://www.vishay.com/docs/28773/crcwce3.pdf?src-supplier=Digi-Key; ComponentLink1Description: http://www.vishay.com/docs/28773/crcwce3.pdf?src-supplier=Digi-Key
R15 R23 R25 R28 = Res_0402: Manufacturer: Yageo; Manufacturer Part Number 1: RC0402FR-0710KL; Part Description: RES SMD 10K OHM 1% 1/16W 0402; Temperature Coefficient: ±100ppm/°C; Power (Watts): 0.063W, 1/16W; Value: 10k, 1%; Supplier 1: Digi-Key; Supplier Part Number 1: 311-10.0KLRTR-ND; Resistance (Ohms): 10k; Packaging: Tape & Reel (TR); RoHS: RoHS Compliant; Package / Case: 0402 (1005 Metric); Tolerance: ±1%; Operating Temperature: -55°C ~ 155°C; Size / Dimension: 0.039" L x 0.020" W (1.00mm x 0.50mm); Number of Terminations: 2; Category: Resistors; Height: 0.016" (0.40mm); Supplier Device Package: 0402; Features: Moisture Resistant; Composition: Thick Film
R16 R19 R37 R39 = Res_0402: Manufacturer: Stackpole Electronics Inc; Manufacturer Part Number 1: RMCF0402FT2K20; Part Description: RES SMD 2.2K OHM 1% 1/16W 0402; Resistance (Ohms): 2.2k; Temperature Coefficient: ±100ppm/°C; Power (Watts): 0.063W, 1/16W; Value: 2k2, 1%; Supplier 1: Digi-Key; Supplier Part Number 1: RMCF0402FT2K20CT-ND; Supplier Device Package: 0402; Package / Case: 0402 (1005 Metric); Size / Dimension: 0.039" L x 0.020" W (1.00mm x 0.50mm); Operating Temperature: -55°C ~ 155°C; Composition: Thick Film; Category: Resistors; Features: -; Height: 0.016" (0.40mm); RoHS: RoHS Compliant; Number of Terminations: 2; Packaging: Cut Tape (CT); Tolerance: ±1%
R17 R22 R34 = Res_0402: Manufacturer: Yageo; Part Description: RES SMD 0.0OHM JUMPER 1/16W 0402; Manufacturer Part Number 1: RC0402JR-070RL; Power (Watts): 0.063W, 1/16W; Resistance (Ohms): 0.0; Tolerance: Jumper; Supplier 1: Digi-Key; Supplier Part Number 1: 311-0.0JRTR-ND; Composition: Thick Film; Package / Case: 0402 (1005 Metric); Category: Resistors; Value: 0R; Features: Moisture Resistant; Height: 0.016" (0.40mm); Number of Terminations: 2; Operating Temperature: -55°C ~ 155°C; Packaging: Tape & Reel (TR); RoHS: RoHS Compliant; Size / Dimension: 0.039" L x 0.020" W (1.00mm x 0.50mm); Supplier Device Package: 0402; Temperature Coefficient: -
R18 R20 R21 R24 R27 R29 R30 = Res_0402: Manufacturer Part Number 1: RC0402JR-070RL; Manufacturer: Yageo; Part Description: RES SMD 0.0OHM JUMPER 1/16W 0402; Resistance (Ohms): 0.0; Tolerance: Jumper; Power (Watts): 0.063W, 1/16W; Value: 0R; Supplier 1: Digi-Key; Supplier Part Number 1: 311-0.0JRTR-ND; Category: Resistors; Temperature Coefficient: -; Features: Moisture Resistant; Supplier Device Package: 0402; Height: 0.016" (0.40mm); Package / Case: 0402 (1005 Metric); Operating Temperature: -55°C ~ 155°C; Size / Dimension: 0.039" L x 0.020" W (1.00mm x 0.50mm); Composition: Thick Film; Packaging: Tape & Reel (TR); Number of Terminations: 2; RoHS: RoHS Compliant
R26 R31 R32 = Res_0402: Manufacturer 1: Yageo; Manufacturer Part Number 1: RC0402FR-07470RL; Part Description: 470 Ohms ±1% 0.063W, 1/16W Chip Resistor 0402 (1005 Metric) Moisture Resistant Thick Film; Power Rating: 62.5mW; Temperature Coefficient: 100ppm/°C; Voltage Rating: 50V; Max Power Dissipation: 63mW; Value: 470R, 1%; Supplier 1: Digi-Key; Supplier Part Number 1: 311-470LRCT-ND; Stock 1: 1652476; Pricing 1: 1=0,10000, 10=0,01600, 100=0,00660, 1000=0,00299, 2500=0,00259, 5000=0,00214 (USD); RoHS: Yes; Case/Package: 0402; Case Code (Metric): 1005; Case Code (Imperial): 0402; Size Code: 0402; Min Operating Temperature: -55°C; Max Operating Temperature: 155°C; Packaging: Tape and Reel; Tolerance: 1%; Resistance: 470R; Number of Terminations: 2; Features: Moisture Resistant; Package Quantity: 1; Resistor Type: Thick Film; Termination: SMD/SMT; Series: RC; Resistance Tolerance: 1%; Construction: Rectangular; Length: 1mm; Width: 0.02inch; Height: 0.016inch; Depth: 0.5mm; Lead Free: Lead Free; REACH SVHC: Unknown; Military Standard: Not; RoHS Compliant: Yes; Manufacturer: Yageo
R33 = Res_0402: Manufacturer: Stackpole Electronics Inc; Manufacturer Part Number 1: RMCF0402FT1K00; Part Description: RES SMD 1K OHM 1% 1/16W 0402; Temperature Coefficient: ±100ppm/°C; Power (Watts): 0.063W, 1/16W; Value: 1k, 1%; Supplier 1: Digi-Key; Supplier Part Number 1: RMCF0402FT1K00TR-ND; Package / Case: 0402 (1005 Metric); Supplier Device Package: 0402; Height: 0.016" (0.40mm); Size / Dimension: 0.039" L x 0.020" W (1.00mm x 0.50mm); Number of Terminations: 2; Packaging: Cut Tape (CT); Category: Resistors; Composition: Thick Film; Resistance (Ohms): 1k; Tolerance: ±1%; Features: Moisture Resistant; Operating Temperature: -55°C ~ 155°C; RoHS: RoHS Compliant
R35 R40 = Res_0402: Manufacturer: Yageo; Manufacturer Part Number 1: RC0402FR-07220RL; Part Description: 220 Ohms ±1% 0.063W, 1/16W Chip Resistor 0402 (1005 Metric) Moisture Resistant Thick Film; Power Rating: 62.5mW; Voltage Rating: 50V; Temperature Coefficient: 100ppm/°C; Max Power Dissipation: 63mW; Value: 220R, 1%; Supplier 1: Digi-Key; Supplier Part Number 1: 311-220LRCT-ND; Stock 1: 2362142; Pricing 1: 1=0,10000, 10=0,01500, 100=0,00610, 1000=0,00275, 2500=0,00239, 5000=0,00197 (USD); RoHS: Yes; Case/Package: 0402; Number of Pins: 2; Case Code (Imperial): 0402; Case Code (Metric): 1005; Size Code: 0402; Min Operating Temperature: -55°C; Max Operating Temperature: 155°C; Resistance: 220R; Tolerance: 1%; Packaging: Tape and Reel; Voltage Rating (DC): 50V; Termination: SMD/SMT; Resistor Type: Thick Film; Number of Terminations: 2; Features: Moisture Resistant; Series: RC; Resistance Tolerance: 1%; Technology: THICK FILM; Construction: Rectangular; Package Quantity: 1; Length: 1mm; Width: 0.02inch; Height: 0.016inch; Depth: 0.5mm; REACH SVHC: No SVHC; Lead Free: Lead Free; RoHS Compliant: Yes; Military Standard: Not; ComponentLink1URL: https://datasheet.ciiva.com/11819/0900766b80c66297-11819466.pdf?src-supplier=RSComponents; ComponentLink1Description: https://datasheet.ciiva.com/11819/0900766b80c66297-11819466.pdf?src-supplier=RSComponents; ComponentLink2URL: https://datasheet.ciiva.com/2453/pyu-r-int-thick-7-2453461.pdf?src-supplier=Digi-Key; ComponentLink2Description: https://datasheet.ciiva.com/2453/pyu-r-int-thick-7-2453461.pdf?src-supplier=Digi-Key; ComponentLink3URL: https://datasheet.ciiva.com/2453/pyu-r-int-thick-7-2453462.pdf?src-supplier=Digi-Key; ComponentLink3Description: https://datasheet.ciiva.com/2453/pyu-r-int-thick-7-2453462.pdf?src-supplier=Digi-Key; ComponentLink4URL: https://datasheet.ciiva.com/2453/pyu-r-int-thick-7-2453460.pdf?src-supplier=Digi-Key; ComponentLink4Description: https://datasheet.ciiva.com/2453/pyu-r-int-thick-7-2453460.pdf?src-supplier=Digi-Key; ComponentLink5URL: https://datasheet.ciiva.com/16746/pyu-rc0402-51-rohs-l-6-r-16746831.pdf?src-supplier=Future+Electronics; ComponentLink5Description: https://datasheet.ciiva.com/16746/pyu-rc0402-51-rohs-l-6-r-16746831.pdf?src-supplier=Future+Electronics
R36 R38 = Res_0402: Manufacturer Part Number 1: RMCF0402FT100R; Manufacturer: Stackpole Electronics Inc.; Part Description: RES SMD 100 OHM 1% 1/16W 0402; Power (Watts): 0.063W, 1/16W; Temperature Coefficient: ±100ppm/°C; Resistance (Ohms): 100; Value: 100R, 1%; Supplier 1: Digi-Key; Supplier Part Number 1: RMCF0402FT100RDKR-ND; Packaging: Digi-Reel®; Composition: Thick Film; Number of Terminations: 2; Package / Case: 0402 (1005 Metric); RoHS: RoHS Compliant; Category: Resistors; Size / Dimension: 0.039" L x 0.020" W (1.00mm x 0.50mm); Tolerance: ±1%; Supplier Device Package: 0402; Features: -; Height: 0.016" (0.40mm); Operating Temperature: -55°C ~ 155°C
VD1-VD8 = DIODE_TVS: Manufacturer 1: Sangdest Microelectronics; Manufacturer Part Number: SD03LCC; Part Description: 19V Clamp 20A (8/20µs) Ipp Tvs Diode Surface Mount SOD-323; ComponentLink1URL: https://datasheet.ciiva.com/29588/littelfuse-tvs-diode-array-sp4020-datasheet-pdf-29588193.pdf?src-supplier=Digi-Key; ComponentLink1Description: https://datasheet.ciiva.com/29588/littelfuse-tvs-diode-array-sp4020-datasheet-pdf-29588193.pdf?src-supplier=Digi-Key; ComponentLink2URL: https://datasheet.ciiva.com/24111/littelfuse-sp4020-267385-24111169.pdf?src-supplier=Mouser; ComponentLink2Description: https://datasheet.ciiva.com/24111/littelfuse-sp4020-267385-24111169.pdf?src-supplier=Mouser; Supplier 1: Digi-Key; Supplier Part Number 1: 1655-SD03LCCCT-ND; Stock 1: 8808; Pricing 1: 1=0,37000, 10=0,27300, 100=0,15460, 500=0,10240, 1000=0,07851 (USD); RoHS: No; Manufacturer: Sangdest Microelectronics; Manufacturer Part Number 1: SD03LCC
VT1 = NDS331N: Manufacturer: Infineon Technologies; Manufacturer Part Number 1: IRLML6244TRPBF; Part Description: N-Channel 20V 6.3A (Ta) 1.3W (Ta) Surface Mount Micro3™/SOT-23; FET Type: N-Channel; Current - Continuous Drain (Id) @ 25°C: 6.3A (Ta); Drive Voltage (Max Rds On,  Min Rds On): 2.5V, 4.5V; Vgs(th) (Max) @ Id: 1.1V @ 10µA; Gate Charge (Qg) (Max) @ Vgs: 8.9nC @ 4.5V; Input Capacitance (Ciss) (Max) @ Vds: 700pF @ 16V; Vgs (Max): ±12V; Power Dissipation (Max): 1.3W (Ta); Rds On (Max) @ Id, Vgs: 21 mOhm @ 6.3A, 4.5V; Supplier 1: Digi-Key; Supplier Part Number 1: IRLML6244TRPBFTR-ND; RoHS: RoHS Compliant; Category: Discrete Semiconductor Products; Stock 1: 21000; Pricing 1: 3000=0.09979 (USD); Packaging: Tape & Reel (TR); Part Status: Active; Technology: MOSFET (Metal Oxide); FET Feature: -; Operating Temperature: -55°C ~ 150°C (TJ); Mounting Type: Surface Mount; Supplier Device Package: Micro3™/SOT-23; Package / Case: TO-236-3, SC-59, SOT-23-3; ComponentLink1URL: https://www.infineon.com/dgdl/irlml6244pbf.pdf?fileId=5546d462533600a4015356686fed261f; ComponentLink1Description: https://www.infineon.com/dgdl/irlml6244pbf.pdf?fileId=5546d462533600a4015356686fed261f

## Sheet 07_Misc_2.SchDoc: Misc 2
size A3; Organization: Lime Microsystems; Address1: Surrey Tech Centre; Address2: Guildford GU2 7YG; Address3: Surrey; Address4: United Kingdom; Revision: 1.4; SheetNumber: 7; SheetTotal: 15
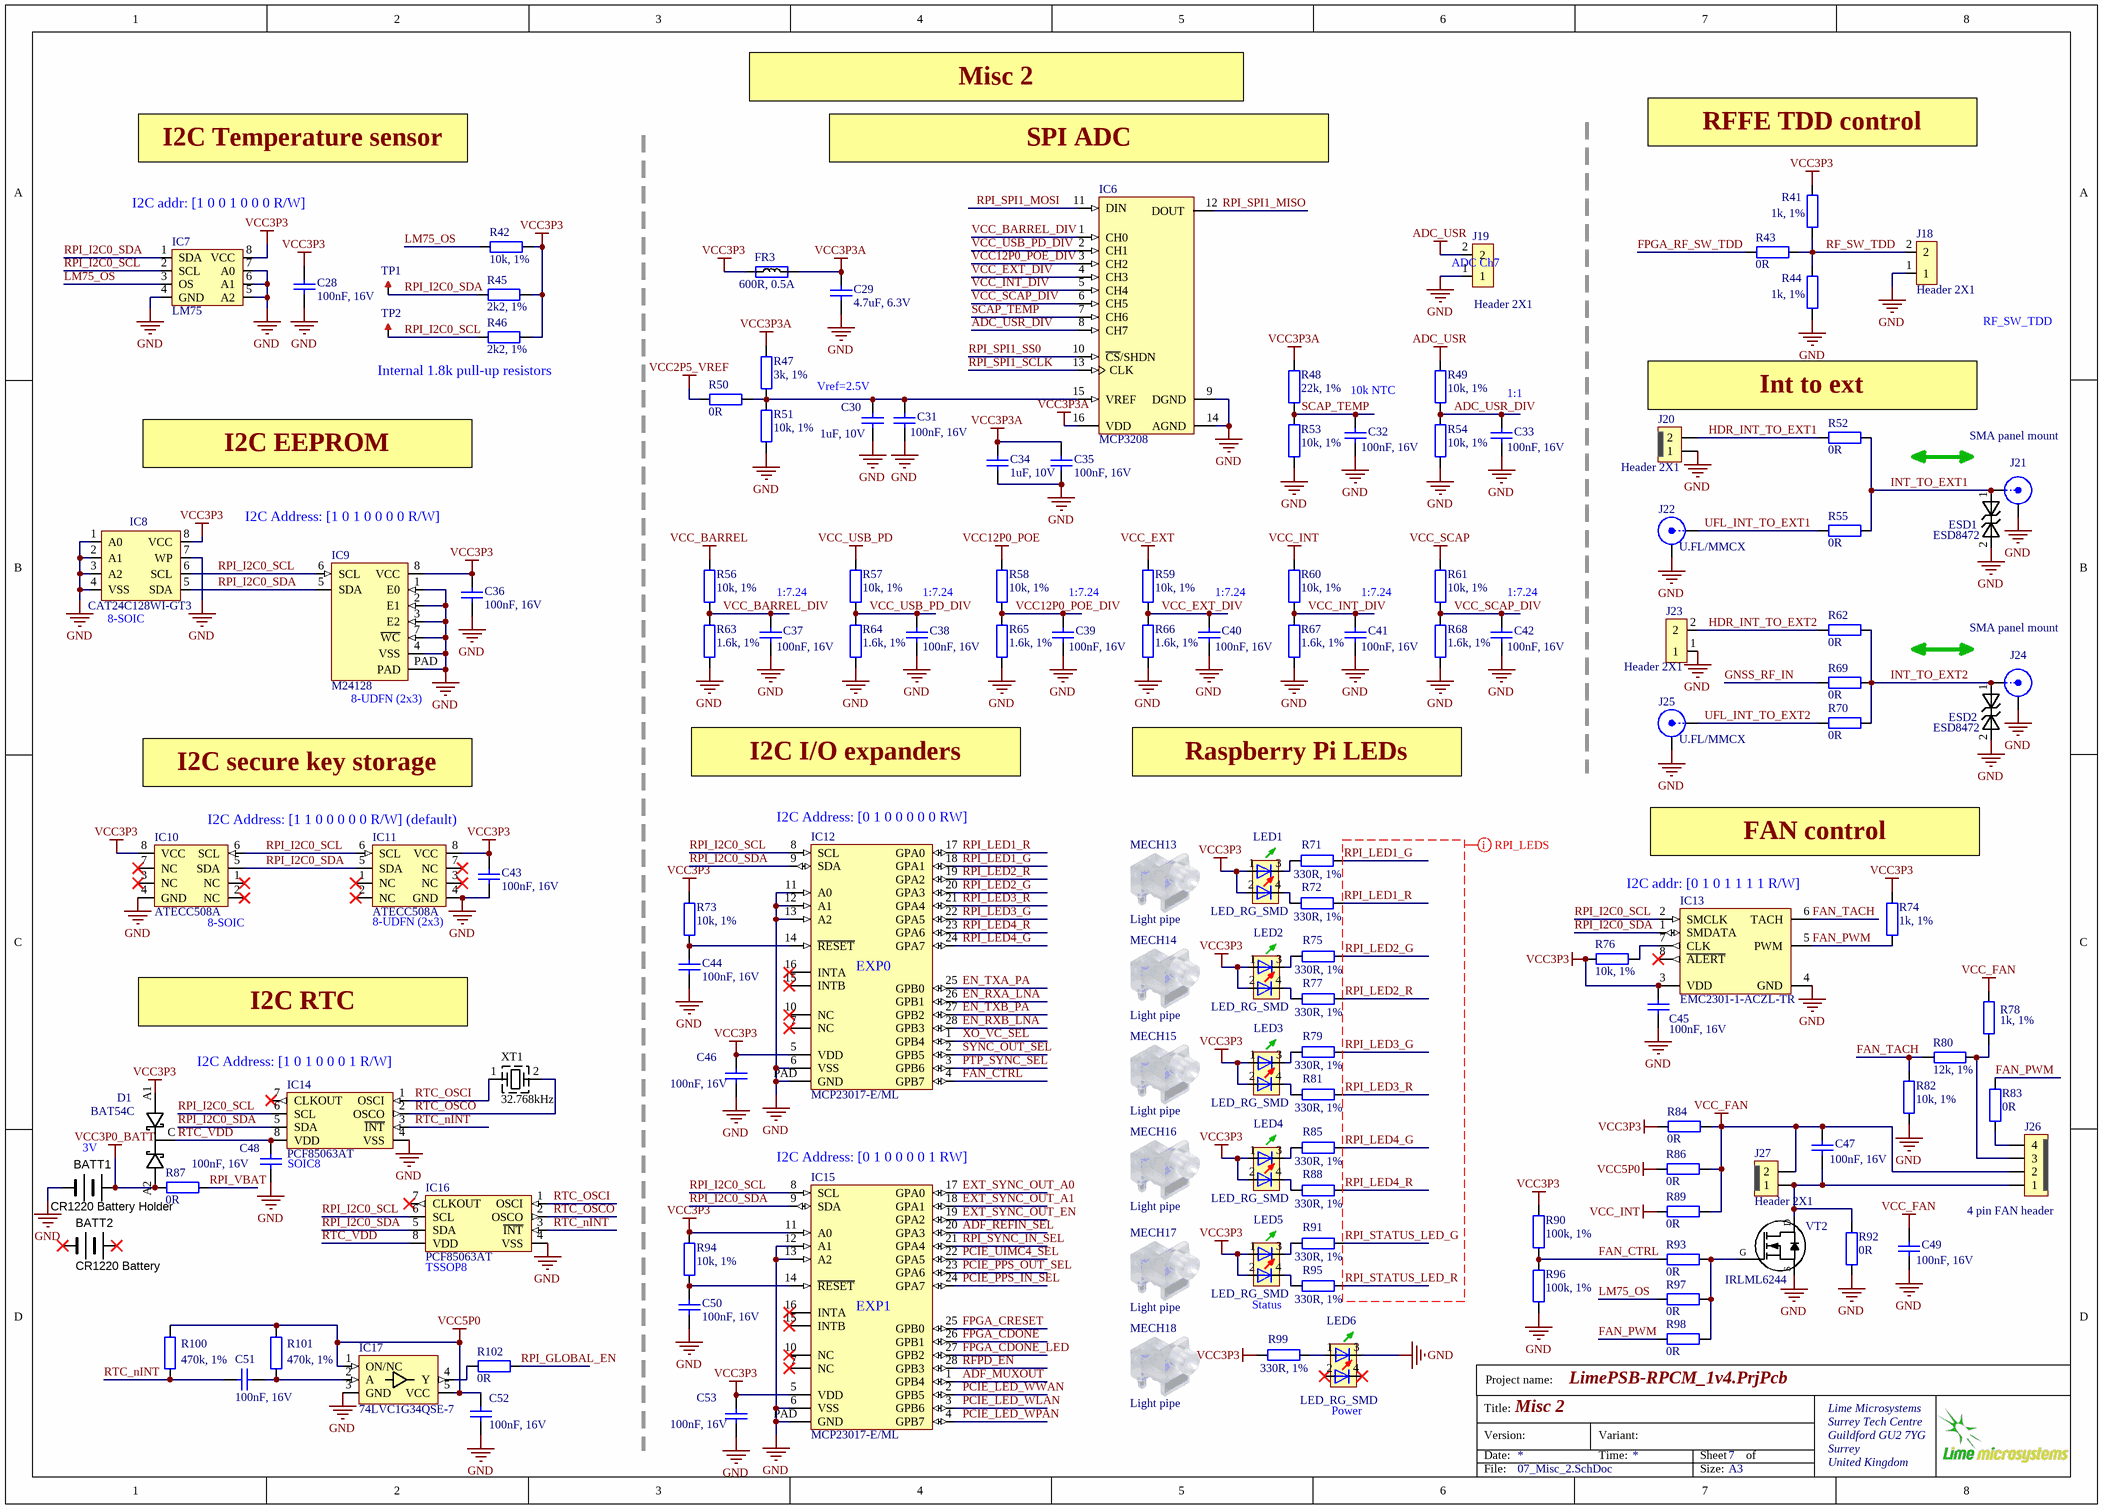
[diagram p6: 07_Misc_2.SchDoc]

### Parts
BATT1  CR1220 Battery Holder  [CR1220_SMD_holder]
BATT2  CR1220 Battery  (mechanical)
C28  100nF, 16V  [CAP0402]
C29  4.7uF, 6.3V  [CAP0402]
C30  1uF, 10V  [CAP0402]
C31  100nF, 16V  [CAP0402]
C32  100nF, 16V  [CAP0402]
C33  100nF, 16V  [CAP0402]
C34  1uF, 10V  [CAP0402]
C35  100nF, 16V  [CAP0402]
C36  100nF, 16V  [CAP0402]
C37  100nF, 16V  [CAP0402]
C38  100nF, 16V  [CAP0402]
C39  100nF, 16V  [CAP0402]
C40  100nF, 16V  [CAP0402]
C41  100nF, 16V  [CAP0402]
C42  100nF, 16V  [CAP0402]
C43  100nF, 16V  [CAP0402]
C44  100nF, 16V  [CAP0402]
C45  100nF, 16V  [CAP0402]
C46  100nF, 16V  [CAP0402]
C47  100nF, 16V  [CAP0402]
C48  100nF, 16V  [CAP0402]
C49  100nF, 16V  [CAP0402]
C50  100nF, 16V  [CAP0402]
C51  100nF, 16V  [CAP0402]
C52  100nF, 16V  [CAP0402]
C53  100nF, 16V  [CAP0402]
D1  BAT54C  [BAT54C_SOT23-3]
ESD1  ESD8472  [ESD8472_X3DFN2]
ESD2  ESD8472  [ESD8472_X3DFN2]
FR3  600R, 0.5A  [RES0402]
IC6  MCP3208  [MCP3208-CI/SL_SOIC16]
IC7  LM75  [HWSON8_LM75]
IC8  CAT24C128WI-GT3  [SOIC127P600-8DL_v2]
IC9  M24128  [M24128-DFMC6TG]
IC10  ATECC508A  [SOIC127P600-8DL_v2]
IC11  ATECC508A  [ATECC508A_UDFN8]
IC12  MCP23017-E/ML  [MCP23017-E/ML_QFN28]
IC13  EMC2301-1-ACZL-TR  [EMC2301-1-ACZL-TR_MOTOR_DRIVER_TSSOP8]
IC14  PCF85063AT  [PCF85063AT_RTC_SOIC-8]
IC15  MCP23017-E/ML  [MCP23017-E/ML_QFN28]
IC16  PCF85063AT  [PCF85063AT_RTC_TSSOP8]
IC17  74LVC1G34QSE-7  [74AHCT1G126SE-7_BUFFER_SOT353]
J18  Header 2X1  [HDR_1x2]
J19  Header 2X1  [HDR_1x2]
J20  Header 2X1  [Header1x2_TH_LOCKING]
J21  SMA panel mount  [SMA_connector_side]
J22  U.FL/MMCX  [MMCX_UFL_conn_u]
J23  Header 2X1  [HDR_1x2]
J24  SMA panel mount  [SMA_connector_side]
J25  U.FL/MMCX  [MMCX_UFL_conn_u]
J26  4 pin FAN header  [Header1x4_TH_LOCKING_v2]
J27  Header 2X1  [Header1x2_TH_LOCKING]
LED1  LED_RG_SMD  [LED-2x0603]
LED2  LED_RG_SMD  [LED-2x0603]
LED3  LED_RG_SMD  [LED-2x0603]
LED4  LED_RG_SMD  [LED-2x0603]
LED5  LED_RG_SMD  [LED-2x0603]
LED6  LED_RG_SMD  [LED-2x0603]
MECH13  Light pipe  [LIGHT_PIPE_RIGHT_ANGLE_SLP3-200-100-F]
MECH14  Light pipe  [LIGHT_PIPE_RIGHT_ANGLE_SLP3-200-100-F]
MECH15  Light pipe  [LIGHT_PIPE_RIGHT_ANGLE_SLP3-200-100-F]
MECH16  Light pipe  [LIGHT_PIPE_RIGHT_ANGLE_SLP3-200-100-F]
MECH17  Light pipe  [LIGHT_PIPE_RIGHT_ANGLE_SLP3-200-100-F]
MECH18  Light pipe  [LIGHT_PIPE_RIGHT_ANGLE_SLP3-200-100-F]
R41  1k, 1%  [RES0402]
R42  10k, 1%  [RES0402]
R43  0R  [RES0402]
R44  1k, 1%  [RES0402]
R45  2k2, 1%  [RES0402]
R46  2k2, 1%  [RES0402]
R47  3k, 1%  [RES0402]
R48  22k, 1%  [RES0402]
R49  10k, 1%  [RES0402]
R50  0R  [RES0402_v2]
R51  10k, 1%  [RES0402]
R52  0R  [RES0402_v2]
R53  10k, 1%  [RES0402]
R54  10k, 1%  [RES0402]
R55  0R  [RES0402_v2]
R56  10k, 1%  [RES0402]
R57  10k, 1%  [RES0402]
R58  10k, 1%  [RES0402]
R59  10k, 1%  [RES0402]
R60  10k, 1%  [RES0402]
R61  10k, 1%  [RES0402]
R62  0R  [RES0402_v2]
R63  1.6k, 1%  [RES0402]
R64  1.6k, 1%  [RES0402]
R65  1.6k, 1%  [RES0402]
R66  1.6k, 1%  [RES0402]
R67  1.6k, 1%  [RES0402]
R68  1.6k, 1%  [RES0402]
R69  0R  [RES0402_v2]
R70  0R  [RES0402_v2]
R71  330R, 1%  [RES0402]
R72  330R, 1%  [RES0402]
R73  10k, 1%  [RES0402]
R74  1k, 1%  [RES0402]
R75  330R, 1%  [RES0402]
R76  10k, 1%  [RES0402]
R77  330R, 1%  [RES0402]
R78  1k, 1%  [RES0402]
R79  330R, 1%  [RES0402]
R80  12k, 1%  [RES0402]
R81  330R, 1%  [RES0402]
R82  10k, 1%  [RES0402]
R83  0R  [RES0402]
R84  0R  [RES0402]
R85  330R, 1%  [RES0402]
R86  0R  [RES0402]
R87  0R  [RES0402]
R88  330R, 1%  [RES0402]
R89  0R  [RES0402]
R90  100k, 1%  [RES0402]
R91  330R, 1%  [RES0402]
R92  0R  [RES0402]
R93  0R  [RES0402]
R94  10k, 1%  [RES0402]
R95  330R, 1%  [RES0402]
R96  100k, 1%  [RES0402]
R97  0R  [RES0402]
R98  0R  [RES0402]
R99  330R, 1%  [RES0402]
R100  470k, 1%  [RES0402]
R101  470k, 1%  [RES0402]
R102  0R  [RES0402]
TP1  TESTPOINT_PAD  [TP_PAD_1p5MM]  (value not drawn)  (no BOM)
TP2  TESTPOINT_PAD  [TP_PAD_1p5MM]  (value not drawn)  (no BOM)
VT2  IRLML6244  [SOT23-3]
XT1  32.768kHz  [CRYSTAL_2PIN_RTC_RT3215]